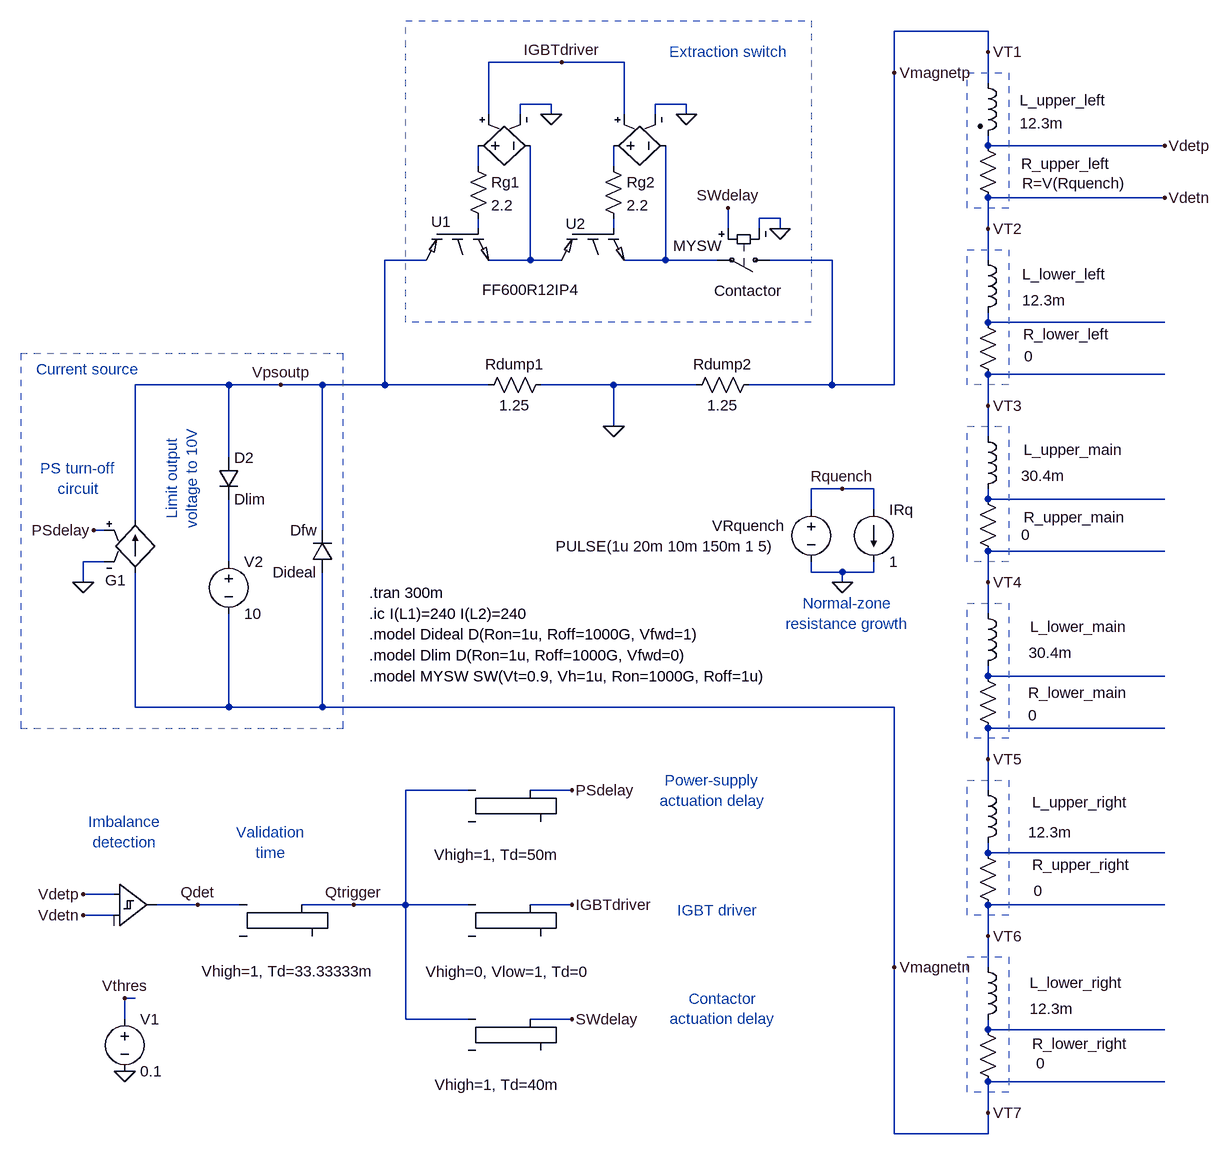
[diagram p0: schematic extraction_circuit_full_magnet_validation_time.asc]
extraction_circuit_full_magnet_validation_time.asc, the LTspice schematic file:
Version 4
SHEET 1 2048 1544
WIRE 544 -592 400 -592
WIRE 544 -560 544 -592
WIRE -112 -544 -224 -544
WIRE -16 -544 -112 -544
WIRE 400 -528 400 -592
WIRE 544 -512 544 -560
WIRE -128 -480 -176 -480
WIRE 80 -480 32 -480
WIRE -224 -464 -224 -544
WIRE -176 -464 -176 -480
WIRE -128 -464 -128 -480
WIRE -16 -464 -16 -544
WIRE 32 -464 32 -480
WIRE 80 -464 80 -480
WIRE 544 -416 544 -432
WIRE 816 -416 544 -416
WIRE -240 -384 -240 -416
WIRE -32 -384 -32 -416
WIRE 816 -336 544 -336
WIRE 224 -304 192 -304
WIRE -240 -288 -240 -304
WIRE -32 -288 -32 -304
WIRE 144 -288 144 -320
WIRE 192 -288 192 -304
WIRE 224 -288 224 -304
WIRE 544 -288 544 -336
WIRE -320 -240 -384 -240
WIRE -160 -240 -160 -416
WIRE -160 -240 -224 -240
WIRE -112 -240 -160 -240
WIRE 48 -240 48 -416
WIRE 48 -240 -16 -240
WIRE 128 -240 48 -240
WIRE 304 -240 208 -240
WIRE 544 -240 544 -288
WIRE 544 -144 544 -160
WIRE 816 -144 544 -144
WIRE 816 -64 544 -64
WIRE -624 -48 -768 -48
WIRE -544 -48 -624 -48
WIRE -480 -48 -544 -48
WIRE -384 -48 -384 -240
WIRE -384 -48 -480 -48
WIRE -224 -48 -384 -48
WIRE -32 -48 -144 -48
WIRE 96 -48 -32 -48
WIRE 304 -48 304 -240
WIRE 304 -48 176 -48
WIRE 400 -48 400 -528
WIRE 400 -48 304 -48
WIRE 544 -16 544 -64
WIRE -32 16 -32 -48
WIRE 544 32 544 -16
WIRE -624 64 -624 -48
WIRE 320 112 272 112
WIRE 368 112 320 112
WIRE 544 128 544 112
WIRE 816 128 544 128
WIRE 272 144 272 112
WIRE 368 144 368 112
WIRE -768 160 -768 -48
WIRE -816 176 -832 176
WIRE -480 176 -480 -48
WIRE 816 208 544 208
WIRE -816 224 -848 224
WIRE -624 224 -624 128
WIRE 272 240 272 224
WIRE 320 240 272 240
WIRE 368 240 368 224
WIRE 368 240 320 240
WIRE -848 256 -848 224
WIRE 320 256 320 240
WIRE 544 256 544 208
WIRE 544 304 544 256
WIRE 544 400 544 384
WIRE 816 400 544 400
WIRE -768 448 -768 240
WIRE -624 448 -624 304
WIRE -624 448 -768 448
WIRE -480 448 -480 240
WIRE -480 448 -624 448
WIRE 400 448 -480 448
WIRE 816 480 544 480
WIRE 544 528 544 480
WIRE -256 576 -352 576
WIRE -96 576 -160 576
WIRE 544 576 544 528
WIRE 544 672 544 656
WIRE 816 672 544 672
WIRE -800 736 -848 736
WIRE -672 752 -736 752
WIRE -608 752 -672 752
WIRE -432 752 -512 752
WIRE -352 752 -352 576
WIRE -352 752 -432 752
WIRE -256 752 -352 752
WIRE -96 752 -160 752
WIRE 816 752 544 752
WIRE -800 768 -848 768
WIRE 544 800 544 752
WIRE 400 848 400 448
WIRE 544 848 544 800
WIRE -768 896 -784 896
WIRE -784 928 -784 896
WIRE -352 928 -352 752
WIRE -256 928 -352 928
WIRE -96 928 -160 928
WIRE 544 944 544 928
WIRE 816 944 544 944
WIRE 816 1024 544 1024
WIRE 544 1072 544 1024
WIRE 400 1104 400 848
WIRE 544 1104 544 1072
WIRE 544 1104 400 1104
FLAG 320 256 0
FLAG 320 112 Rquench
FLAG -96 576 PSdelay
FLAG -96 928 SWdelay
FLAG 224 -288 0
FLAG 144 -320 SWdelay
FLAG -432 752 Qtrigger
FLAG -32 16 0
FLAG -848 736 Vdetp
FLAG -848 768 Vdetn
FLAG -784 1008 0
FLAG -784 896 Vthres
FLAG 400 -528 Vmagnetp
FLAG 400 848 Vmagnetn
FLAG -544 -48 Vpsoutp
FLAG -672 752 Qdet
FLAG -832 176 PSdelay
FLAG -848 256 0
FLAG 816 -416 Vdetp
FLAG 816 -336 Vdetn
FLAG 544 -288 VT2
FLAG 544 -16 VT3
FLAG 544 256 VT4
FLAG 544 528 VT5
FLAG 544 800 VT6
FLAG 544 -560 VT1
FLAG 544 1072 VT7
FLAG -96 752 IGBTdriver
FLAG -128 -464 0
FLAG 80 -464 0
FLAG -112 -544 IGBTdriver
SYMBOL ind 528 16 R0
WINDOW 0 71 36 Left 2
WINDOW 3 67 76 Left 2
SYMATTR InstName L_upper_main
SYMATTR Value 30.4m
SYMATTR SpiceLine Rser=0 Rpar=0
SYMBOL res -240 -32 R270
WINDOW 0 32 56 VTop 2
WINDOW 3 0 56 VBottom 2
SYMATTR InstName Rdump1
SYMATTR Value 1.25
SYMBOL sw 224 -240 R90
WINDOW 0 47 -4 VRight 2
WINDOW 3 -22 90 VRight 2
SYMATTR InstName Contactor
SYMATTR Value MYSW
SYMBOL ind 528 288 R0
WINDOW 0 81 36 Left 2
WINDOW 3 79 76 Left 2
SYMATTR InstName L_lower_main
SYMATTR Value 30.4m
SYMATTR SpiceLine Rser=0 Rpar=0
SYMBOL res 528 112 R0
WINDOW 0 71 44 Left 2
WINDOW 3 67 71 Left 2
SYMATTR InstName R_upper_main
SYMATTR Value 0
SYMBOL voltage 272 128 R0
WINDOW 0 -152 41 Left 2
WINDOW 3 -393 72 Left 2
WINDOW 123 0 0 Left 0
WINDOW 39 0 0 Left 0
SYMATTR InstName VRquench
SYMATTR Value PULSE(1u 20m 10m 150m 1 5)
SYMBOL Digital\\diffschmtbuf -800 688 R0
WINDOW 0 27 104 Invisible 2
SYMATTR InstName A1
SYMATTR SpiceLine Vt=100m, Vh=1m, Vhigh=1, Vlow=0, Trise=1n, Tfall=1n
SYMBOL res 80 -32 R270
WINDOW 0 32 56 VTop 2
WINDOW 3 0 56 VBottom 2
SYMATTR InstName Rdump2
SYMATTR Value 1.25
SYMBOL diode -464 240 R180
WINDOW 0 24 64 Left 2
WINDOW 3 24 0 Left 2
SYMATTR InstName Dfw
SYMATTR Value Dideal
SYMBOL Digital\\srflop -208 528 R0
WINDOW 0 -47 148 Invisible 2
WINDOW 39 -100 147 Left 2
SYMATTR InstName A2
SYMATTR SpiceLine Vhigh=1, Td=50m
SYMBOL Digital\\srflop -208 880 R0
WINDOW 0 -47 -4 Invisible 2
WINDOW 39 -99 149 Left 2
SYMATTR InstName A5
SYMATTR SpiceLine Vhigh=1, Td=40m
SYMBOL voltage -784 912 R0
WINDOW 123 0 0 Left 0
WINDOW 39 0 0 Left 0
SYMATTR InstName V1
SYMATTR Value 0.1
SYMBOL voltage -624 208 R0
WINDOW 123 0 0 Left 0
WINDOW 39 0 0 Left 0
SYMATTR InstName V2
SYMATTR Value 10
SYMBOL diode -640 64 R0
SYMATTR InstName D2
SYMATTR Value Dlim
SYMBOL current 368 144 R0
WINDOW 123 0 0 Left 0
WINDOW 39 0 0 Left 0
SYMATTR InstName IRq
SYMATTR Value 1
SYMBOL Digital\\srflop -560 704 R0
WINDOW 0 -47 148 Invisible 2
WINDOW 39 -106 150 Left 2
SYMATTR InstName A3
SYMATTR SpiceLine Vhigh=1, Td=33.33333m
SYMBOL ind2 528 -528 R0
WINDOW 0 65 42 Left 2
WINDOW 3 65 78 Left 2
SYMATTR InstName L_upper_left
SYMATTR Value 12.3m
SYMATTR Type ind
SYMATTR SpiceLine Rser=0 Rpar=0
SYMBOL ind 528 -256 R0
WINDOW 0 69 38 Left 2
WINDOW 3 69 78 Left 2
SYMATTR InstName L_lower_left
SYMATTR Value 12.3m
SYMATTR SpiceLine Rser=0 Rpar=0
SYMBOL ind 528 560 R0
WINDOW 0 84 34 Left 2
WINDOW 3 78 80 Left 2
SYMATTR InstName L_upper_right
SYMATTR Value 12.3m
SYMATTR SpiceLine Rser=0 Rpar=0
SYMBOL ind 528 832 R0
WINDOW 0 80 40 Left 2
WINDOW 3 80 80 Left 2
SYMATTR InstName L_lower_right
SYMATTR Value 12.3m
SYMATTR SpiceLine Rser=0 Rpar=0
SYMBOL g -768 144 R0
WINDOW 3 24 96 Invisible 2
WINDOW 0 -46 109 Left 2
SYMATTR Value table(0V 240A, 1nV 0A)
SYMATTR InstName G1
SYMBOL res 528 -160 R0
WINDOW 0 70 34 Left 2
WINDOW 3 72 68 Left 2
SYMATTR InstName R_lower_left
SYMATTR Value 0
SYMBOL res 528 -432 R0
WINDOW 0 67 44 Left 2
WINDOW 3 69 74 Left 2
SYMATTR InstName R_upper_left
SYMATTR Value R=V(Rquench)
SYMBOL res 528 384 R0
WINDOW 0 78 42 Left 2
WINDOW 3 78 76 Left 2
SYMATTR InstName R_lower_main
SYMATTR Value 0
SYMBOL res 528 656 R0
WINDOW 0 84 34 Left 2
WINDOW 3 86 74 Left 2
SYMATTR InstName R_upper_right
SYMATTR Value 0
SYMBOL res 528 928 R0
WINDOW 0 84 38 Left 2
WINDOW 3 90 68 Left 2
SYMATTR InstName R_lower_right
SYMATTR Value 0
SYMBOL FF600R12IP4 -320 -288 M90
WINDOW 0 -11 38 VLeft 2
WINDOW 3 94 237 VLeft 2
SYMATTR InstName U1
SYMBOL FF600R12IP4 -112 -288 M90
WINDOW 0 -8 37 VLeft 2
WINDOW 3 104 135 Invisible 2
SYMATTR InstName U2
SYMBOL Digital\\srflop -208 704 R0
WINDOW 0 -47 -4 Invisible 2
WINDOW 39 -113 151 Left 2
SYMATTR InstName A4
SYMATTR SpiceLine Vhigh=0, Vlow=1, Td=0
SYMBOL res -256 -400 R0
SYMATTR InstName Rg1
SYMATTR Value 2.2
SYMBOL res -48 -400 R0
SYMATTR InstName Rg2
SYMATTR Value 2.2
SYMBOL e -256 -416 M90
WINDOW 0 31 34 Invisible 2
WINDOW 3 36 82 Invisible 2
SYMATTR InstName E1
SYMATTR Value table(0 0, 1n 15)
SYMBOL e -48 -416 M90
WINDOW 0 35 28 Invisible 2
WINDOW 3 36 82 Invisible 2
SYMATTR InstName E2
SYMATTR Value table(0 0, 1n 15)
TEXT -408 272 Left 2 !.tran 300m
TEXT -408 304 Left 2 !.ic I(L1)=240 I(L2)=240
TEXT -408 400 Left 2 !.model MYSW SW(Vt=0.9, Vh=1u, Ron=1000G, Roff=1u)
TEXT -408 336 Left 2 !.model Dideal D(Ron=1u, Roff=1000G, Vfwd=1)
TEXT -408 368 Left 2 !.model Dlim D(Ron=1u, Roff=1000G, Vfwd=0)
TEXT -696 96 VCenter 2 ;Limit output\nvoltage to 10V
TEXT 120 576 Center 2 ;Power-supply\nactuation delay
TEXT 136 912 Center 2 ;Contactor\nactuation delay
TEXT 328 304 Center 2 ;Normal-zone\nresistance growth
TEXT 144 -560 Center 2 ;Extraction switch
TEXT -560 656 Center 2 ;Validation\ntime
TEXT -784 640 Center 2 ;Imbalance\ndetection
TEXT -856 96 Center 2 ;PS turn-off\ncircuit
TEXT 128 760 Center 2 ;IGBT driver
TEXT -840 -72 Center 2 ;Current source
RECTANGLE Normal 576 -320 512 -528 2
RECTANGLE Normal 576 -48 512 -256 2
RECTANGLE Normal 576 224 512 16 2
RECTANGLE Normal 576 496 512 288 2
RECTANGLE Normal 576 768 512 560 2
RECTANGLE Normal 576 1040 512 832 2
RECTANGLE Normal 272 -144 -352 -608 2
RECTANGLE Normal -944 480 -448 -96 2

The netlist it stands for:
* extraction_circuit_full_magnet_validation_time.asc
L_upper_main VT3 N008 30.4m Rser=0 Rpar=0
Rdump1 Vpsoutp 0 1.25
S§Contactor VT1 N006 SWdelay 0 MYSW
L_lower_main VT4 N010 30.4m Rser=0 Rpar=0
R_upper_main N008 VT4 0
VRquench Rquench 0 PULSE(1u 20m 10m 150m 1 5)
A1 Vdetp VT2 0 0 0 0 Qdet 0 SCHMITT Vt=100m, Vh=1m, Vhigh=1, Vlow=0, Trise=1n, Tfall=1n
Rdump2 0 VT1 1.25
Dfw VT7 Vpsoutp Dideal
A2 Qtrigger 0 0 0 0 0 PSdelay 0 SRFLOP Vhigh=1, Td=50m
A5 Qtrigger 0 0 0 0 0 SWdelay 0 SRFLOP Vhigh=1, Td=40m
V1 Vthres 0 0.1
V2 N009 VT7 10
D2 Vpsoutp N009 Dlim
IRq Rquench 0 1
A3 Qdet 0 0 0 0 0 Qtrigger 0 SRFLOP Vhigh=1, Td=33.33333m
L_upper_left VT1 Vdetp 12.3m Rser=0 Rpar=0
L_lower_left VT2 N007 12.3m Rser=0 Rpar=0
L_upper_right VT5 N011 12.3m Rser=0 Rpar=0
L_lower_right VT6 N012 12.3m Rser=0 Rpar=0
G1 VT7 Vpsoutp PSdelay 0 table(0V 240A, 1nV 0A)
R_lower_left N007 VT3 0
R_upper_left Vdetp VT2 R=V(Rquench)
R_lower_main N010 VT5 0
R_upper_right N011 VT6 0
R_lower_right N012 VT7 0
XU1 Vpsoutp N003 N005 FF600R12IP4  ; pins C G E
XU2 N005 N004 N006 FF600R12IP4  ; pins C G E
A4 Qtrigger 0 0 0 0 0 IGBTdriver 0 SRFLOP Vhigh=0, Vlow=1, Td=0
Rg1 N001 N003 2.2
Rg2 N002 N004 2.2
E1 N001 N005 IGBTdriver 0 table(0 0, 1n 15)
E2 N002 N006 IGBTdriver 0 table(0 0, 1n 15)
.model D D
.lib standard.dio
.tran 300m
.ic I(L1)=240 I(L2)=240
.model MYSW SW(Vt=0.9, Vh=1u, Ron=1000G, Roff=1u)
.model Dideal D(Ron=1u, Roff=1000G, Vfwd=1)
.model Dlim D(Ron=1u, Roff=1000G, Vfwd=0)
* Limit output
* voltage to 10V
* Power-supply
* actuation delay
* Contactor
* actuation delay
* Normal-zone
* resistance growth
* Extraction switch
* Validation
* time
* Imbalance
* detection
* PS turn-off
* circuit
* IGBT driver
* Current source
.lib FF600R12IP4.lib
.backanno
.end